# EAGLE design pcb-breakout-ltc3625-tps63031 (EAGLE 7.5.0)
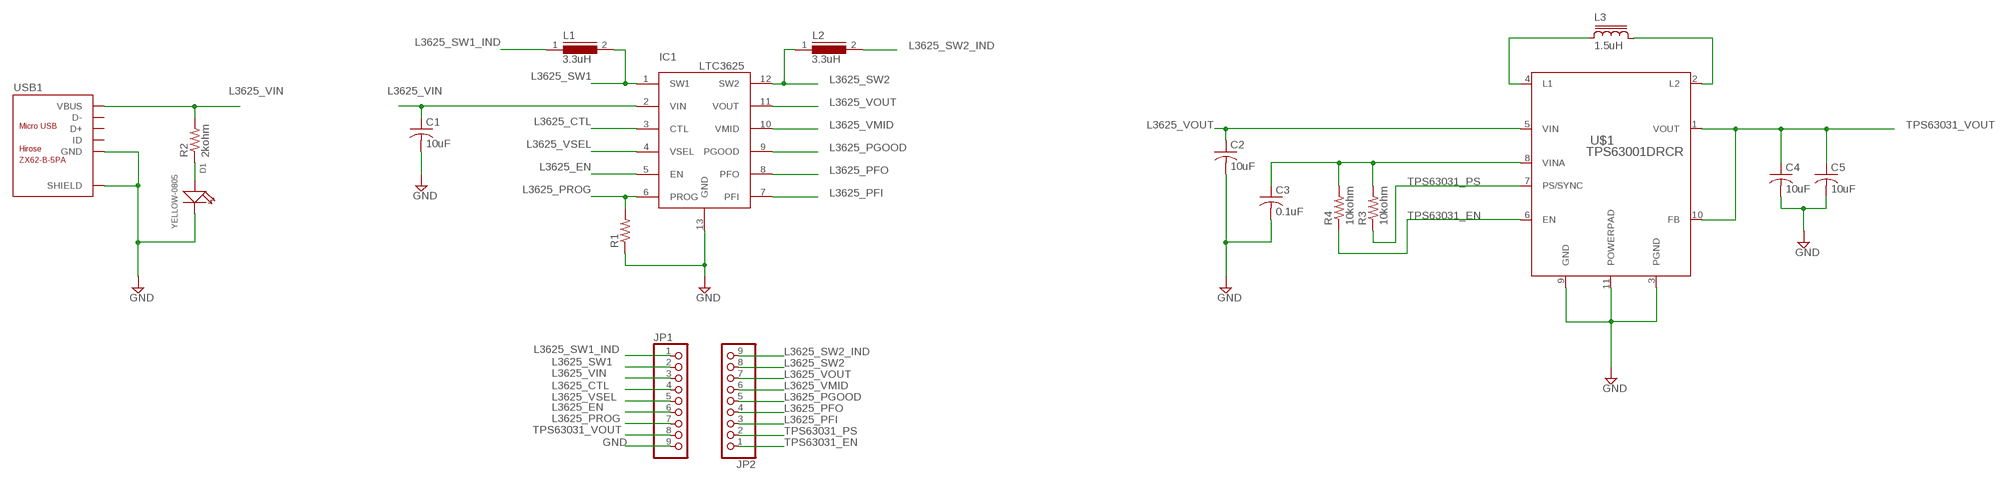
[diagram p0: schematic, sheet 1]

## Parts
C1  10uF  C-USC0805  [C0805]
C2  10uF  C-USC0805  [C0805]
C3  0.1uF  C-USC0805  [C0805]
C4  10uF  C-USC0805  [C0805]
C5  10uF  C-USC0805  [C0805]
D1  YELLOW-0805  SMD-LED-CLEAR-YELLOW(0805)  [LED-0805]
IC1  LTC3625EDE  [DFN12(DE)]
JP1  PINHD-1X9  [1X09]
JP2  PINHD-1X9  [1X09]
L1  3.3uH  DR73  [DR73]
L2  3.3uH  DR73  [DR73]
L3  1.5uH  LPS3015  [LPS3015]
R1  R-US_R0805  [R0805]
R2  2kohm  R-US_R0805  [R0805]
R3  10kohm  R-US_R0805  [R0805]
R4  10kohm  R-US_R0805  [R0805]
U$1  TPS63001DRCR  [NEWPVSON-N10]
USB1  ZX62-B-5PA  MICRO-USB-SMD(ZX62-B-5PA)  [MICRO-USB5+6P-SMD-0.65-AB]

## Nets
GND: C1.2 C2.2 C3.2 C4.2 C5.2 D1.- IC1.13(GND) JP1.9 R1.1 U$1.3(PGND) U$1.9(GND) U$1.11(POWERPAD) USB1.5(GND) USB1.P1(SHIELD) USB1.P2(SHIELD) USB1.P3(SHIELD) USB1.P4(SHIELD) USB1.P5(SHIELD) USB1.P6(SHIELD)
L3625_CTL: IC1.3(CTL) JP1.4
L3625_EN: IC1.5(EN) JP1.6
L3625_PFI: IC1.7(PFI) JP2.3
L3625_PFO: IC1.8(PFO) JP2.4
L3625_PGOOD: IC1.9(PGOOD) JP2.5
L3625_PROG: IC1.6(PROG) JP1.7 R1.2
L3625_SW1: IC1.1(SW1) JP1.2 L1.2
L3625_SW1_IND: JP1.1 L1.1
L3625_SW2: IC1.12(SW2) JP2.8 L2.1
L3625_SW2_IND: JP2.9 L2.2
L3625_VIN: C1.1 IC1.2(VIN) JP1.3 R2.2 USB1.1(VBUS)
L3625_VMID: IC1.10(VMID) JP2.6
L3625_VOUT: C2.1 IC1.11(VOUT) JP2.7 U$1.5(VIN)
L3625_VSEL: IC1.4(VSEL) JP1.5
N$1: L3.2 U$1.2(L2)
N$2: L3.1 U$1.4(L1)
N$3: D1.+ R2.1
N$5: C3.1 R3.2 R4.2 U$1.8(VINA)
TPS63031_EN: JP2.1 R4.1 U$1.6(EN)
TPS63031_PS: JP2.2 R3.1 U$1.7(PS/SYNC)
TPS63031_VOUT: C4.1 C5.1 JP1.8 U$1.1(VOUT) U$1.10(FB)
Unconnected: USB1.2(D-) USB1.3(D+) USB1.4(ID)

## Library data of the parts
C1-C5 = rcl:C-US: CAPACITOR, American symbol
D1 = Seeed-OPL-Diode:SMD-LED-CLEAR-YELLOW(0805): 304090039; MPN: 17-215UYC/S530-A3/TR8
IC1 = ltc3625:LTC3625
JP1 JP2 = pinhead:PINHD-1X9: PIN HEADER
L1 L2 = inductors:DR73: High Power Density, High Efficiency, Shielded Inductors Source: coiltronics_dr_series.pdf
L3 = inductor-coilcraft:LPS3015: Shielded Power Inductor
R1-R4 = resistor:R-US_: RESISTOR, American symbol
U$1 = TPS63031:TPS63001DRCR
USB1 = Seeed-OPL-Connector:MICRO-USB-SMD(ZX62-B-5PA): 320010005; MPN: ZX62-B-5PA

## Board
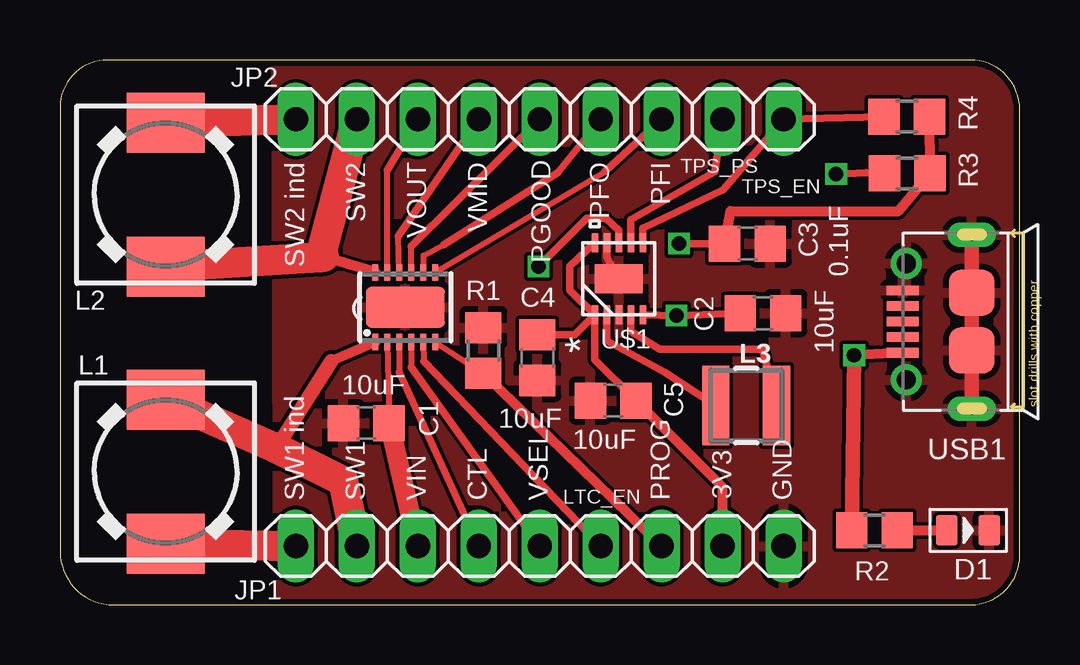
[diagram p1: board, top side]
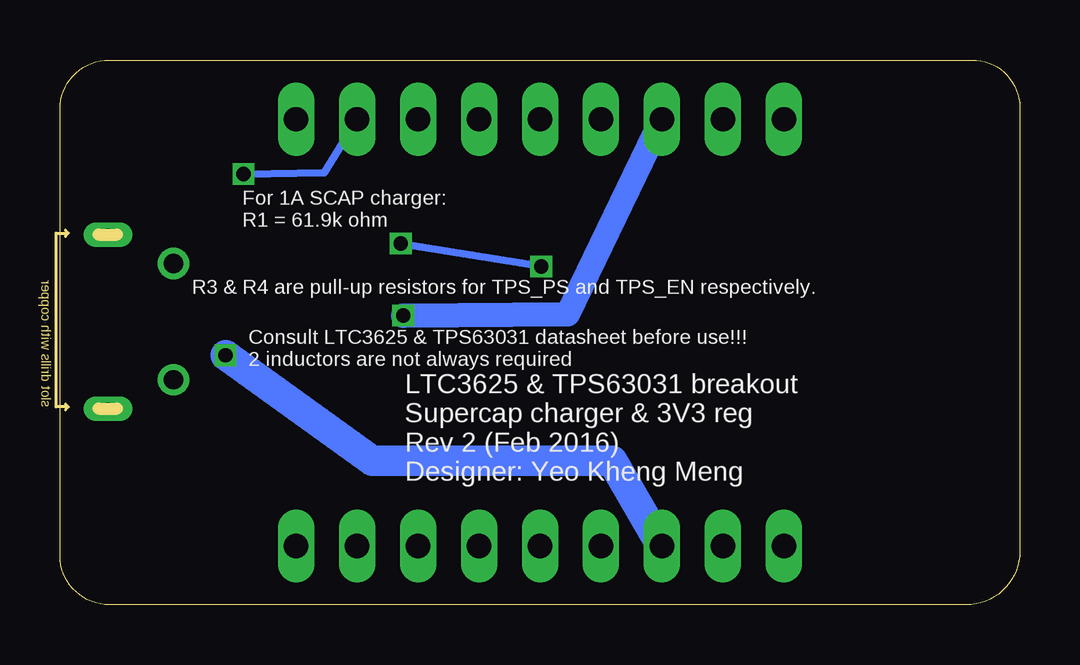
[diagram p2: board, bottom side, seen from below]

Size 39.99 x 22.7 mm. Coordinates in mm from the lower left corner, seen from the top.
Outline: 2.23,0 37.94,0 arc90 39.99,2.05 39.99,20.64 arc90 37.93,22.7 1.99,22.7 arc90 0,20.73 0,2.23 arc90 2.23,0
Copper layers (1*16): Top 0.035mm / dielectric 1.5mm / Bottom 0.035mm
Design rules "Elecrow_2-layer_eagle_rule": minimum track width 6mil, minimum drill 12mil, track to track 6mil, track to pad 6mil, pad to pad 6mil, via to via 6mil, smd to smd 0mil, copper to edge 10mil, drill to drill 10mil, minimum pad ring 10mil, minimum via ring 6mil, stop-mask expansion 2mil, vias tented up to drill 100mil, thermal gap 10mil

### Footprints (pad centres in the part's own frame; a part is rotated, then mirrored left to right if it is on the bottom)
C0805 = smd 1.3 x 1.5: 1 -0.95,0; 2 0.95,0
LED-0805 = smd 0.889 x 1.27: + -0.889,0; - 0.889,0
DFN12(DE) = smd 0.25 x 0.7: 1 -1.25,-1.45; 2 -0.75,-1.45; 3 -0.25,-1.45; 4 0.25,-1.45; 5 0.75,-1.45; 6 1.25,-1.45; 7 1.25,1.45; 8 0.75,1.45; 9 0.25,1.45; 10 -0.25,1.45; 11 -0.75,1.45; 12 -1.25,1.45 | smd 3.3 x 1.7: 13 0,0
1X09 = drill 1.016 long: 1 -10.16,0; 2 -7.62,0; 3 -5.08,0; 4 -2.54,0; 5 0,0; 6 2.54,0; 7 5.08,0; 8 7.62,0; 9 10.16,0
DR73 = smd 2.5 x 3.25: 1 -3,0; 2 3,0
LPS3015 = smd 1.14 x 3.3: 1 -1.27,0; 2 1.27,0
R0805 = smd 1.3 x 1.5: 1 -0.95,0; 2 0.95,0
NEWPVSON-N10 = smd 0.8 x 0.28: 1 -1.5,1; 2 -1.5,0.5; 3 -1.5,0; 4 -1.5,-0.5; 5 -1.5,-1; 6 1.5,-1; 7 1.5,-0.5; 8 1.5,0; 9 1.5,0.5; 10 1.5,1 | smd 1.2 x 2: 11 0,0
MICRO-USB5+6P-SMD-0.65-AB = smd 0.4 x 1.35: 1 -1.3,2.875; 2 -0.65,2.875; 3 0,2.875; 4 0.65,2.875; 5 1.3,2.875 | smd 1.9 x 1.9: P1 -1.2,0; P2 1.2,0 | drill 0.508 pad 1.016 long: P3 -3.625,0; P4 3.625,0 | drill 0.8: P5 -2.425,2.73; P6 2.425,2.73

### Placement (x,y rotation side)
C1  12.76,7.57 180 top
C2  29.29,12.15 0 top
C3  28.64,15.05 0 top
C4  19.89,10.3 270 top
C5  23.05,8.51 180 top
D1  37.84,3.1 0 top
IC1  14.39,12.4 0 top
JP1  19.99,2.45 0 top
JP2  19.99,20.23 180 top
L1  4.4,5.55 90 top
L2  4.4,17.09 90 top
L3  28.59,8.3 180 top
R1  17.64,10.6 270 top
R2  33.94,3.1 180 top
R3  35.3,17.98 0 top
R4  35.28,20.34 0 top
U$1  23.29,13.59 90 top
USB1  37.99,11.8 90 top

### Tracks (layer width: path | path; a pad name or v marks a point on that pad's centre or on a via)
GND
  Top 0.305: U$1.9 22.79,14.5 U$1.11
  Top 0.61: USB1.P3 USB1.P1 USB1.P2 USB1.P4
  pour Top: 9,22.95 40.99,22.95 40.99,-0.35 9.1,-0.35
L3625_CTL
  Top 0.254: IC1.3 14.14,9.7
  Top 0.305: 14.14,9.7 JP1.4
L3625_EN
  Top 0.254: IC1.5 15.15,10.15
  Top 0.305: 15.15,10.15 JP1.6
L3625_PFI
  Top 0.254: IC1.7 22.69,18.05
  Top 0.305: 22.69,18.05 JP2.3
L3625_PFO
  Top 0.254: IC1.8 15.15,14.55 15.99,15
  Top 0.305: 15.99,15 20.74,18 JP2.4
L3625_PGOOD
  Top 0.254: IC1.9 14.64,14.95
  Top 0.305: JP2.5 14.64,14.95
L3625_PROG
  Top 0.254: IC1.6 R1.2
  Top 0.406: R1.2 JP1.7
L3625_SW1
  Top 0.406: IC1.1 11.3,10.15
  Top 0.61: 11.3,10.15 9,6.52
  Top 1.27: L1.2 9,6.52 10.67,5.71 11.8,5.15 JP1.2
L3625_SW1_IND
  Top 1.27: JP1.1 L1.1
L3625_SW2
  Top 0.406: IC1.12 10.99,14.5
  Top 1.27: L2.1 10.85,14.49 | 10.85,14.49 10.99,14.5 | JP2.8 10.85,14.49
L3625_SW2_IND
  Top 1.27: L2.2 JP2.9
L3625_VIN  (via drill 0.6)
  Top 0.254: IC1.2 C1.1
  Top 0.406: USB1.1 v33.09,10.4
  Top 0.61: R2.2 v33.09,10.4
  Top 0.813: JP1.3 C1.1
  Bottom 1.27: v33.09,10.4 26.99,6 16.99,6 JP1.3
L3625_VMID
  Top 0.254: IC1.10 14.1,15.35
  Top 0.305: 14.1,15.35 JP2.6
L3625_VOUT  (via drill 0.6)
  Top 0.254: IC1.11 13.64,18.1
  Top 0.305: 13.64,18.1 JP2.7 | U$1.5 v25.69,12.05 C2.1
  Bottom 1.016: JP2.7 18.84,12.1 v25.69,12.05
L3625_VSEL
  Top 0.254: IC1.4 14.64,9.9
  Top 0.305: 14.64,9.9 JP1.5
N$1
  Top 0.305: L3.2 25.19,9.7 22.79,11 U$1.2
N$2
  Top 0.305: U$1.4 23.79,11.4 24.99,10.65 29.29,10.65 L3.1
N$3
  Top 0.406: R2.1 D1.+
N$5  (via drill 0.6)
  Top 0.305: v25.79,15.05 C3.1 | U$1.8 23.29,15.6 22.74,16.1 21.94,16.1 v19.94,14.1
  Top 0.406: C3.1 27.94,16.4 34.94,16.4 R3.2 R4.2
  Bottom 0.305: v19.94,14.1 v25.79,15.05
TPS63031_EN
  Top 0.305: U$1.6 24.29,15.7 27.64,17.3 JP2.1 R4.1
TPS63031_PS  (via drill 0.6)
  Top 0.305: U$1.7 23.79,16.05 27.29,18.05 JP2.2 | v32.34,17.95 33.6,18 R3.1
  Bottom 0.305: JP2.2 28.99,18 v32.34,17.95
TPS63031_VOUT
  Top 0.305: U$1.1 22.29,10.22 C5.1 | C4.1 21.45,11.25 U$1.1 | U$1.10 21.24,14.1 21.24,13.1 U$1.1
  Top 0.406: JP1.8 27.61,4.9 C5.1

### Text on the board
tPlace: PGOOD | TPS_PS | SW2 ind | SW2 | VOUT | VMID | PFO | PFI | TPS_EN | LTC_EN | SW1 ind | SW1 | VIN | CTL | VSEL | PROG | 3V3 | GND
bPlace: For 1A SCAP charger: / R1 = 61.9k ohm | R3 & R4 are pull-up resistors for TPS_PS and TPS_EN respectively. | Consult LTC3625 & TPS63031 datasheet before use!!! / 2 inductors are not always required | LTC3625 & TPS63031 breakout / Supercap charger & 3V3 reg / Rev 2 (Feb 2016) / Designer: Yeo Kheng Meng